# Altium schematic sheet Primary MCU.SchDoc
size A3; ENG_APP_DATE: --/--/--; DSN_APP_DATE: --/--/--; CHK_APP_DATE: --/--/--; Sheet_Number: 1; Author1: Russell MacGregor; VersionControl_Repository: BatteryMonitorSpring2025; Date: 03/09/2025; Organization: Machine Intellgence Laboratory; Des1: This is the main MCU for the; Des2: Battery Monitor Board.; Revision: 0; SheetNumber: 1; SheetTotal: 4; Time: 12:13 AM
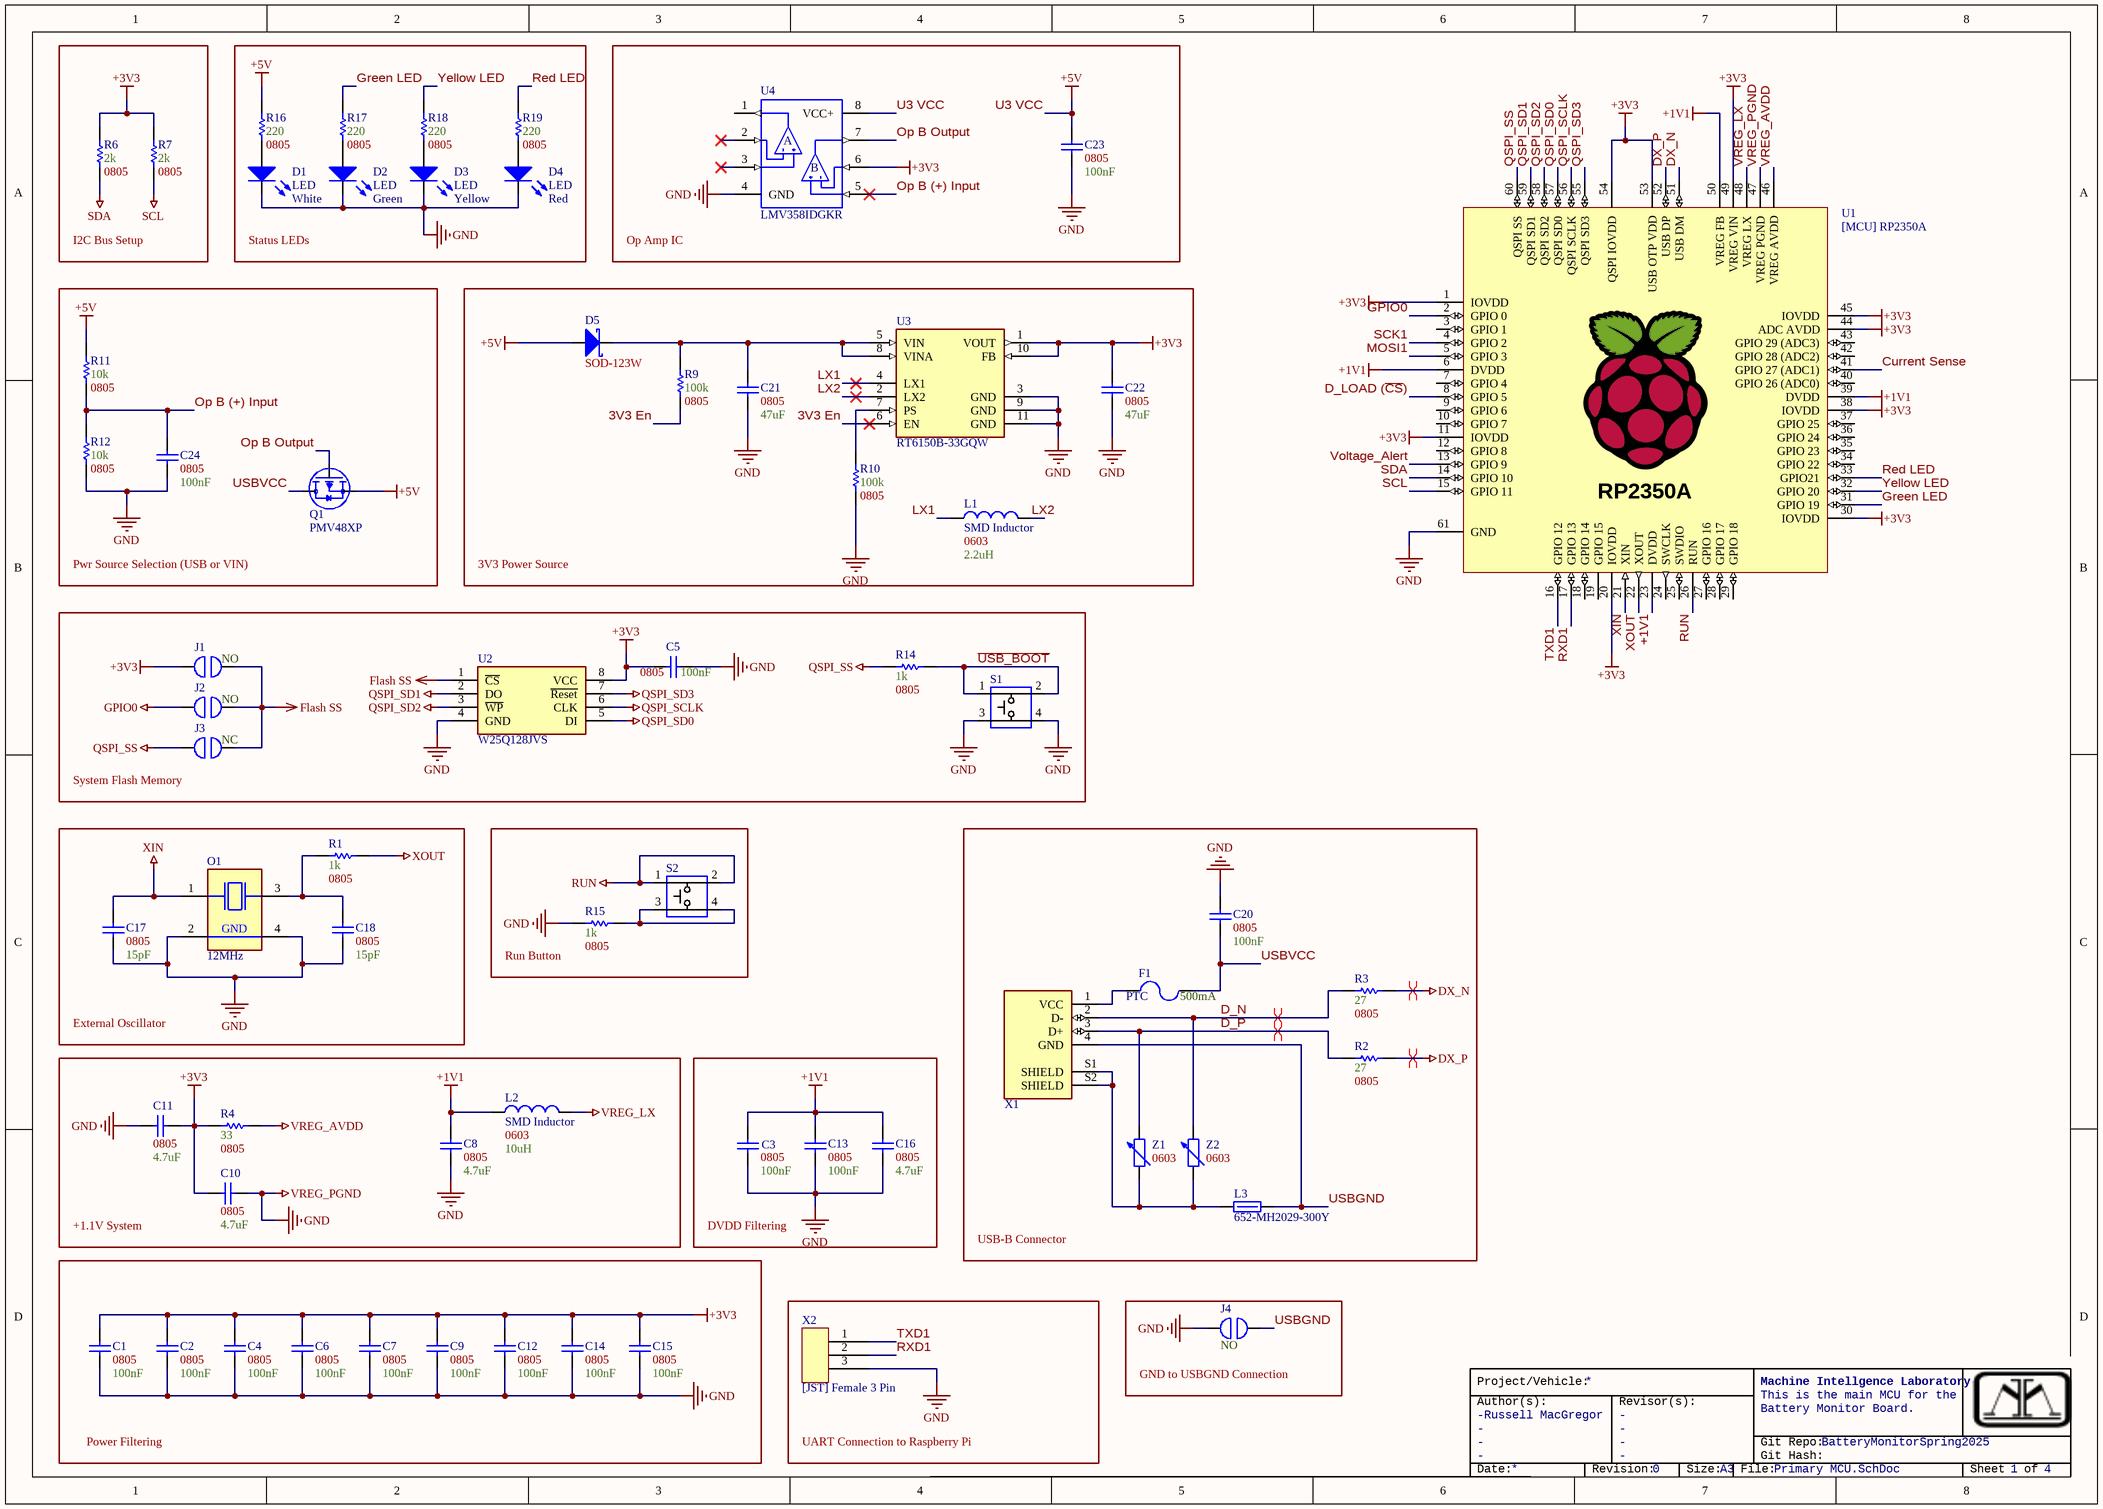
[diagram p0: Primary MCU.SchDoc]

## Parts
C1  Size Package: 0805  Capacitance: 100nF  [[Cap] SMD 0805]  (hidden comment: [Cap] SMD Nonpolarized)
C2  Size Package: 0805  Capacitance: 100nF  [[Cap] SMD 0805]  (hidden comment: [Cap] SMD Nonpolarized)
C3  Size Package: 0805  Capacitance: 100nF  [[Cap] SMD 0805]  (hidden comment: [Cap] SMD Nonpolarized)
C4  Size Package: 0805  Capacitance: 100nF  [[Cap] SMD 0805]  (hidden comment: [Cap] SMD Nonpolarized)
C5  Size Package: 0805  Capacitance: 100nF  [[Cap] SMD 0805]  (hidden comment: [Cap] SMD Nonpolarized)
C6  Size Package: 0805  Capacitance: 100nF  [[Cap] SMD 0805]  (hidden comment: [Cap] SMD Nonpolarized)
C7  Size Package: 0805  Capacitance: 100nF  [[Cap] SMD 0805]  (hidden comment: [Cap] SMD Nonpolarized)
C8  Size Package: 0805  Capacitance: 4.7uF  [[Cap] SMD 0805]  (hidden comment: [Cap] SMD Nonpolarized)
C9  Size Package: 0805  Capacitance: 100nF  [[Cap] SMD 0805]  (hidden comment: [Cap] SMD Nonpolarized)
C10  Size Package: 0805  Capacitance: 4.7uF  [[Cap] SMD 0805]  (hidden comment: [Cap] SMD Nonpolarized)
C11  Size Package: 0805  Capacitance: 4.7uF  [[Cap] SMD 0805]  (hidden comment: [Cap] SMD Nonpolarized)
C12  Size Package: 0805  Capacitance: 100nF  [[Cap] SMD 0805]  (hidden comment: [Cap] SMD Nonpolarized)
C13  Size Package: 0805  Capacitance: 100nF  [[Cap] SMD 0805]  (hidden comment: [Cap] SMD Nonpolarized)
C14  Size Package: 0805  Capacitance: 100nF  [[Cap] SMD 0805]  (hidden comment: [Cap] SMD Nonpolarized)
C15  Size Package: 0805  Capacitance: 100nF  [[Cap] SMD 0805]  (hidden comment: [Cap] SMD Nonpolarized)
C16  Size Package: 0805  Capacitance: 4.7uF  [[Cap] SMD 0805]  (hidden comment: [Cap] SMD Nonpolarized)
C17  Size Package: 0805  Capacitance: 15pF  [[Cap] SMD 0805]  (hidden comment: [Cap] SMD Nonpolarized)
C18  Size Package: 0805  Capacitance: 15pF  [[Cap] SMD 0805]  (hidden comment: [Cap] SMD Nonpolarized)
C20  Size Package: 0805  Capacitance: 100nF  [[Cap] SMD 0805]  (hidden comment: [Cap] SMD Nonpolarized)
C21  Size Package: 0805  Capacitance: 47uF  [[Cap] SMD 0805]  (hidden comment: [Cap] SMD Nonpolarized)
C22  Size Package: 0805  Capacitance: 47uF  [[Cap] SMD 0805]  (hidden comment: [Cap] SMD Nonpolarized)
C23  Size Package: 0805  Capacitance: 100nF  [[Cap] SMD 0805]  (hidden comment: [Cap] SMD Nonpolarized)
C24  Size Package: 0805  Capacitance: 100nF  [[Cap] SMD 0805]  (hidden comment: [Cap] SMD Nonpolarized)
D1  LED  Color: White  [[LED] Thru-Hole, 3mm, White]
D2  LED  Color: Green  [[LED] Thru-Hole, 3mm, Green]
D3  LED  Color: Yellow  [[LED] Thru-Hole, 3mm, Yellow]
D4  LED  Color: Red  [[LED] Thru-Hole, 3mm, Red]
D5  Size Package: SOD-123W  [[Diode] SMD SOD-123W]  (hidden comment: Schottky)
F1  PTC  Trip Current: 500mA  [[PTC] 500mA Trip]
J1  NO/NC: NO  [[Jumper] Solderable Jumper]  (hidden comment: [Jump] SMD Jumper)
J2  NO/NC: NO  [[Jumper] Solderable Jumper]  (hidden comment: [Jump] SMD Jumper)
J3  NO/NC: NC  [[Jumper] Solderable Jumper]  (hidden comment: [Jump] SMD Jumper)
J4  NO/NC: NO  [[Jumper] Solderable Jumper]  (hidden comment: [Jump] SMD Jumper)
L1  SMD Inductor  Size Package: 0603  Inductance: 2.2uH  [[Inductor] SMD 0603]
L2  SMD Inductor  Size Package: 0603  Inductance: 10uH  [[Inductor] SMD 0603]
L3  652-MH2029-300Y  [[Ferrite] SMD Bead 0805 (1)]
O1  12MHz  [[XTAL] SMD 12MHz]
Q1  PMV48XP  [[FET] P-Channel Mosfet]
R1  Resistance: 1k  Size Package: 0805  [[Res] SMD 0805]  (hidden comment: [Res] SMD Resistor)
R2  Resistance: 27  Size Package: 0805  [[Res] SMD 0805]  (hidden comment: [Res] SMD Resistor)
R3  Resistance: 27  Size Package: 0805  [[Res] SMD 0805]  (hidden comment: [Res] SMD Resistor)
R4  Resistance: 33  Size Package: 0805  [[Res] SMD 0805]  (hidden comment: [Res] SMD Resistor)
R6  Resistance: 2k  Size Package: 0805  [[Res] SMD 0805]  (hidden comment: [Res] SMD Resistor)
R7  Resistance: 2k  Size Package: 0805  [[Res] SMD 0805]  (hidden comment: [Res] SMD Resistor)
R9  Resistance: 100k  Size Package: 0805  [[Res] SMD 0805]  (hidden comment: [Res] SMD Resistor)
R10  Resistance: 100k  Size Package: 0805  [[Res] SMD 0805]  (hidden comment: [Res] SMD Resistor)
R11  Resistance: 10k  Size Package: 0805  [[Res] SMD 0805]  (hidden comment: [Res] SMD Resistor)
R12  Resistance: 10k  Size Package: 0805  [[Res] SMD 0805]  (hidden comment: [Res] SMD Resistor)
R14  Resistance: 1k  Size Package: 0805  [[Res] SMD 0805]  (hidden comment: [Res] SMD Resistor)
R15  Resistance: 1k  Size Package: 0805  [[Res] SMD 0805]  (hidden comment: [Res] SMD Resistor)
R16  Resistance: 220  Size Package: 0805  [[Res] SMD 0805]  (hidden comment: [Res] SMD Resistor)
R17  Resistance: 220  Size Package: 0805  [[Res] SMD 0805]  (hidden comment: [Res] SMD Resistor)
R18  Resistance: 220  Size Package: 0805  [[Res] SMD 0805]  (hidden comment: [Res] SMD Resistor)
R19  Resistance: 220  Size Package: 0805  [[Res] SMD 0805]  (hidden comment: [Res] SMD Resistor)
S1  Standard pushbutton  [[Switch] Pushbutton]  (value not drawn)
S2  Standard pushbutton  [[Switch] Pushbutton]  (value not drawn)
U1  [MCU] RP2350A  [[MCU] RP2350A]
U2  W25Q128JVS  [[IC] 16Mb Flash Memory]
U3  RT6150B-33GQW  [[IC] 3V3 Regulator (2)]
U4  LMV358IDGKR  [[IC] Dual Op-Ap]
X1  [Port] USB Type-B Female (Thru-Hole)  [[Port] USB Type-B Thru-Hole]  (value not drawn)
X2  [JST] Female 3 Pin  [[JST] 3PIN]
Z1  Size Package: 0603  [[Inductor] SMD Varistor 0603]  (hidden comment: [Inductor] SMD Varistor)
Z2  Size Package: 0603  [[Inductor] SMD Varistor 0603]  (hidden comment: [Inductor] SMD Varistor)

## Blocks framed on the sheet
I2C Bus Setup: R6 R7
Status LEDs: D1-D4 R16-R19
Op Amp IC: C23 U4
Pwr Source Selection (USB or VIN): C24 Q1 R11 R12
3V3 Power Source: C21 C22 D5 L1 R9 R10 U3
System Flash Memory: C5 J1-J3 R14 S1 U2
External Oscillator: C17 C18 O1 R1
Run Button: R15 S2
USB-B Connector: C20 F1 L3 R2 R3 X1 Z1 Z2
+1.1V System: C8 C10 C11 L2 R4
DVDD Filtering: C3 C13 C16
Power Filtering: C1 C2 C4 C6 C7 C9 C12 C14 C15
UART Connection to Raspberry Pi: X2
GND to USBGND Connection: J4

## Nets
+1V1: C3.2 C8.2 C13.2 C16.2 L2.1 U1.6(DVDD) U1.23(DVDD) U1.39(DVDD) U1.50(VREG_FB)
+3V3: C1.2 C2.2 C4.2 C5.2 C6.2 C7.2 C9.2 C10.2 C11.1 C12.2 C14.2 C15.2 C22.2 J1.1 R4.2 R6.2 R7.2 U1.1(IOVDD) U1.11(IOVDD) U1.20(IOVDD) U1.30(IOVDD) U1.38(IOVDD) U1.44(ADC_AVDD) U1.45(IOVDD) U1.49(VREG_VIN) U1.53(USB_OTP_VDD) U1.54(QSPI_IOVDD) U2.8(VCC) U3.1(VOUT) U3.10(FB) U4.6(2IN-)
DX_N: R3.1 U1.51(USB_DM)
DX_P: R2.1 U1.52(USB_DP)
Flash SS: J1.2 J2.2 J3.2 U2.1(~{CS})
GPIO0: J2.1 U1.2(GPIO_0)
QSPI_SCLK: U1.56(QSPI_SCLK) U2.6(CLK)
QSPI_SD0: U1.57(QSPI_SD0) U2.5(DI)
QSPI_SD1: U1.59(QSPI_SD1) U2.2(DO)
QSPI_SD2: U1.58(QSPI_SD2) U2.3(~{WP})
QSPI_SD3: U1.55(QSPI_SD3) U2.7(~{Reset})
QSPI_SS: J3.1 R14.2 U1.60(QSPI_SS)
RUN: S2.1 S2.2 U1.26(RUN)
SCL: R7.1 U1.15(GPIO_11)
SDA: R6.1 U1.14(GPIO_10)
U3 VCC: C23.2 D5.2(A) Q1.2(S) R11.2 R16.1 U4.8(VCC+)  [also labelled +5V]
VREG_AVDD: R4.1 U1.46(VREG_AVDD)
VREG_LX: L2.2 U1.48(VREG_LX)
VREG_PGND: C1.1 C2.1 C3.1 C4.1 C5.1 C6.1 C7.1 C8.1 C9.1 C10.1 C11.2 C12.1 C13.1 C14.1 C15.1 C16.1 C17.1 C18.1 C20.2 C21.1 C22.1 C23.1 C24.1 D1.2(K) D2.2(K) D3.2(K) D4.2(K) J4.1 O1.2(GND) O1.4(GND) R10.1 R12.1 R15.2 S1.3 S1.4 U1.47(VREG_PGND) U1.61(GND) U2.4(GND) U3.3(GND) U3.9(GND) U3.11(GND) U4.4(GND) X2.3  [also labelled GND]
XIN: C17.2 O1.1(XTAL1) U1.21(XIN)
XOUT: R1.1 U1.22(XOUT)
3V3 En: R9.1 U3.6(EN)
Current Sense: U1.41(GPIO_27_(ADC1))
D_LOAD (~{CS}): U1.8(GPIO_5)
D_N: R3.2 X1.2(D-) Z2.2
D_P: R2.2 X1.3(D+) Z1.2
Green LED: R17.1 U1.31(GPIO_19)
LX1: L1.1 U3.4(LX1)
LX2: L1.2 U3.2(LX2)
MOSI1: U1.5(GPIO_3)
Op B (+) Input: C24.2 R11.1 R12.2 U4.5(2IN+)
Op B Output: Q1.1(G) U4.7(2OUT)
Red LED: R19.1 U1.33(GPIO21)
RXD1: U1.17(GPIO_13) X2.2
SCK1: U1.4(GPIO_2)
TXD1: U1.16(GPIO_12) X2.1
~{USB_BOOT}: R14.1 S1.1 S1.2
USBGND: J4.2 L3.2 X1.4(GND)
USBVCC: C20.1 F1.2 Q1.3(D)
Voltage_Alert: U1.13(GPIO_9)
Yellow LED: R18.1 U1.32(GPIO_20)
NetC18_2: C18.2 O1.3(XTAL2) R1.2
NetC21_2: C21.2 D5.1(K) R9.2 U3.5(VIN) U3.8(VINA)
NetD1_1: D1.1(A) R16.2
NetD2_1: D2.1(A) R17.2
NetD3_1: D3.1(A) R18.2
NetD4_1: D4.1(A) R19.2
NetF1_1: F1.1 X1.1(VCC)
NetL3_1: L3.1 X1.S1(SHIELD) X1.S2(SHIELD) Z1.1 Z2.1
NetR10_2: R10.2 U3.7(PS)
NetR15_1: R15.1 S2.3 S2.4

Not connected (* = marked no-connect by the designer): U1 3(GPIO_1) 7(GPIO_4) 9(GPIO_6) 10(GPIO_7) 12(GPIO_8) 18(GPIO_14) 19(GPIO_15) 24(SWCLK) 25(SWDIO) 27(GPIO_16) 28(GPIO_17) 29(GPIO_18) 34(GPIO_22) 35(GPIO_23) 36(GPIO_24) 37(GPIO_25) 40(GPIO_26_(ADC0)) 42(GPIO_28_(ADC2)) 43(GPIO_29_(ADC3)); U4 1(1OUT) 2(1IN-)* 3(1IN+)*

## Layout directives
differential pair: D_N, D_P, DX_N, DX_P

## Notes on the sheet
- Project/Vehicle:
- Author(s):
- -
- Revisor(s):
- Git Repo:
- Git Hash:
- Date:
- Revision:
- Size:
- A3
- File:
- Sheet
- of
- (in symbol [IC] Dual Op-Amp) A; B
- (in symbol [MCU] RP2350A) RP2350A

## Library data of the parts
D1-D4 = [LED] Thru-Hole 3mm: 3mm LED
D5 = [Diode] SMD Schottky: PMEG6010ELR
F1 = [PTC] 500mA Trip: MF-MSMF050-2 / JLC Part #: C17313; JLC Part #: C17313; Size Package: 1812
J1-J4 = [Jump] SMD Jumper: Solderable jumper
L1 L2 = [Inductor] SMD Inductor: JLC Part #: *; Mouser Part #: *
L3 = [Ferrite] SMD Ferrite Bead (1): Res @ Freq: 30 @ 100MHz; Size Package: 0805
O1 = [XTAL] SMD 12MHz: 815-ABM8-272-T3
Q1 = [FET] P-Channel MOSFET: JLC Part #: C2959854
S1 S2 = [Switch] Pushbutton
U2 = [IC] 16Mb Flash Memory: W25Q128JVSIQ TR
U3 = [IC] 3V3 Regulator (2)
U4 = [IC] Dual Op-Amp: JLC Part #: C105242
X1 = [Port] USB Type-B Female (Thru-Hole): USB-B-S-F-B-TH; JLC Part #: C5714571
C1-C18 C20-C24 = [Cap] SMD Nonpolarized: JLC Part #: *; Mouser Part #: *
Z1 Z2 = [Inductor] SMD Varistor: JLC Part #: C840634